# Altium schematic sheet 6_Magnetorquer_Drivers.SchDoc: Magnetorquer Drivers
size A4; DrawnBy: Sara V. Martinez; Engineer: Flight; Revision: V0.0; SheetNumber: 6; SheetTotal: 7
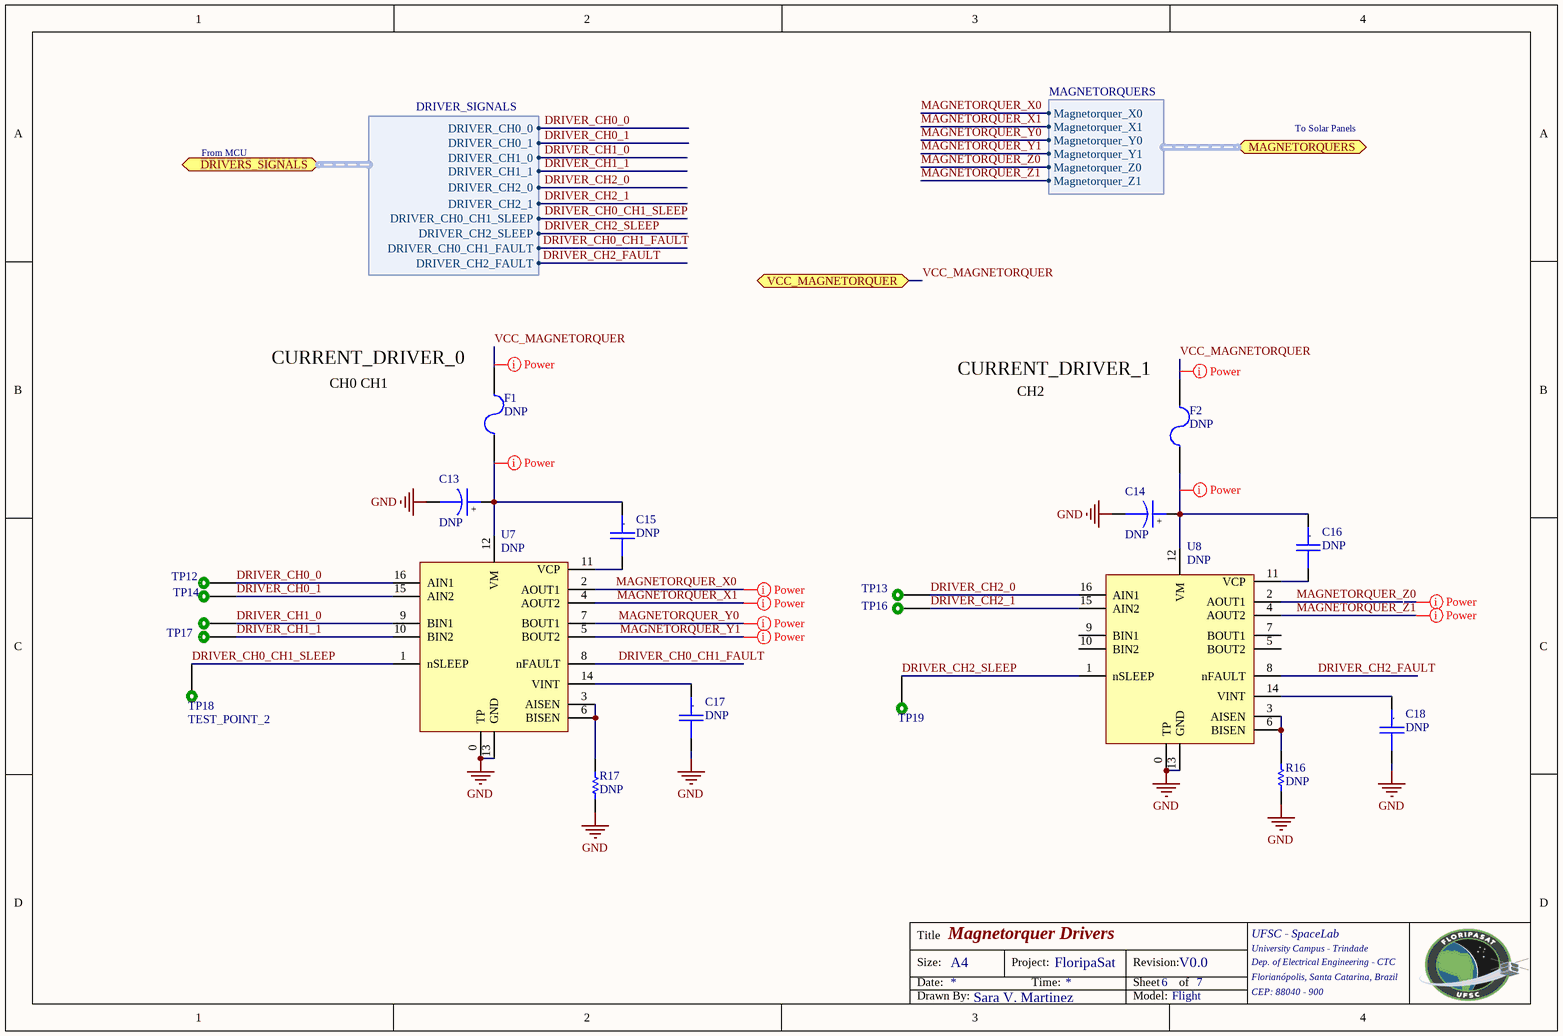
[diagram p0: 6_Magnetorquer_Drivers.SchDoc]

## Parts
C13  DNP  [CC0805_Tantalum]
C14  DNP  [CC0805_Tantalum]
C15  DNP  [CC0805]
C16  DNP  [CC0805]
C17  DNP  [CC0805]
C18  DNP  [CC0805]
F1  DNP  [1206]
F2  DNP  [1206]
R16  DNP  [0805]
R17  DNP  [0805]
TP12  TEST_POINT_2  [TEST_POINT_2]  (value not drawn)  (no BOM)
TP13  TEST_POINT_2  [TEST_POINT_2]  (value not drawn)  (no BOM)
TP14  TEST_POINT_2  [TEST_POINT_2]  (value not drawn)  (no BOM)
TP15  TEST_POINT_2  [TEST_POINT_2]  (value not drawn)  (no BOM)
TP16  TEST_POINT_2  [TEST_POINT_2]  (value not drawn)  (no BOM)
TP17  TEST_POINT_2  [TEST_POINT_2]  (value not drawn)  (no BOM)
TP18  TEST_POINT_2  [TEST_POINT_2]  (no BOM)
TP19  TEST_POINT_2  [TEST_POINT_2]  (value not drawn)  (no BOM)
U7  DNP  [16TTSSOP]
U8  DNP  [16TTSSOP]

## Ports
DRIVERS_SIGNALS (harness DRIVER_SIGNALS), MAGNETORQUERS (harness MAGNETORQUERS), VCC_MAGNETORQUER

## Harnesses
MAGNETORQUERS: Magnetorquer_X0, Magnetorquer_X1, Magnetorquer_Y0, Magnetorquer_Y1, Magnetorquer_Z0, Magnetorquer_Z1
DRIVER_SIGNALS: DRIVER_CH1_1, DRIVER_CH1_0, DRIVER_CH0_1, DRIVER_CH0_0, DRIVER_CH2_0, DRIVER_CH2_1, DRIVER_CH0_CH1_SLEEP, DRIVER_CH2_SLEEP, DRIVER_CH0_CH1_FAULT, DRIVER_CH2_FAULT

## Nets
GND: C13.2 C14.2 C17.2 C18.2 R16.1 R17.1 U7.0(TP) U7.13(GND) U8.0(TP) U8.13(GND)
DRIVER_CH0_0: TP12.1 U7.16(AIN1) ; port DRIVERS_SIGNALS.DRIVER_CH0_0
DRIVER_CH0_1: TP14.1 U7.15(AIN2) ; port DRIVERS_SIGNALS.DRIVER_CH0_1
DRIVER_CH0_CH1_FAULT: U7.8(nFAULT) ; port DRIVERS_SIGNALS.DRIVER_CH0_CH1_FAULT
DRIVER_CH0_CH1_SLEEP: TP18.1 U7.1(nSLEEP) ; port DRIVERS_SIGNALS.DRIVER_CH0_CH1_SLEEP
DRIVER_CH1_0: TP15.1 U7.9(BIN1) ; port DRIVERS_SIGNALS.DRIVER_CH1_0
DRIVER_CH1_1: TP17.1 U7.10(BIN2) ; port DRIVERS_SIGNALS.DRIVER_CH1_1
DRIVER_CH2_0: TP13.1 U8.16(AIN1) ; port DRIVERS_SIGNALS.DRIVER_CH2_0
DRIVER_CH2_1: TP16.1 U8.15(AIN2) ; port DRIVERS_SIGNALS.DRIVER_CH2_1
DRIVER_CH2_FAULT: U8.8(nFAULT) ; port DRIVERS_SIGNALS.DRIVER_CH2_FAULT
DRIVER_CH2_SLEEP: TP19.1 U8.1(nSLEEP) ; port DRIVERS_SIGNALS.DRIVER_CH2_SLEEP
MAGNETORQUER_X0: U7.2(AOUT1) ; port MAGNETORQUERS.Magnetorquer_X0
MAGNETORQUER_X1: U7.4(AOUT2) ; port MAGNETORQUERS.Magnetorquer_X1
MAGNETORQUER_Y0: U7.7(BOUT1) ; port MAGNETORQUERS.Magnetorquer_Y0
MAGNETORQUER_Y1: U7.5(BOUT2) ; port MAGNETORQUERS.Magnetorquer_Y1
MAGNETORQUER_Z0: U8.2(AOUT1) ; port MAGNETORQUERS.Magnetorquer_Z0
MAGNETORQUER_Z1: U8.4(AOUT2) ; port MAGNETORQUERS.Magnetorquer_Z1
VCC_MAGNETORQUER: F1.2 F2.2 ; port VCC_MAGNETORQUER
NetC13_1: C13.1 C15.1 F1.1 U7.12(VM)
NetC14_1: C14.1 C16.1 F2.1 U8.12(VM)
NetC15_2: C15.2 U7.11(VCP)
NetC16_2: C16.2 U8.11(VCP)
NetC17_1: C17.1 U7.14(VINT)
NetC18_1: C18.1 U8.14(VINT)
NetR16_2: R16.2 U8.3(AISEN) U8.6(BISEN)
NetR17_2: R17.2 U7.3(AISEN) U7.6(BISEN)

Not connected (* = marked no-connect by the designer): U8 5(BOUT2) 7(BOUT1) 9(BIN1) 10(BIN2)

## Layout directives
net class Power: (no net found under the mark), MAGNETORQUER_X0, MAGNETORQUER_X1, MAGNETORQUER_Y0, MAGNETORQUER_Y1, MAGNETORQUER_Z1, NetC13_1, NetC14_1, VCC_MAGNETORQUER

## Notes on the sheet
- From MCU
- To Solar Panels
- CURRENT_DRIVER_0
- CURRENT_DRIVER_1
- CH0 CH1
- CH2
- Title
- Size:
- Date:
- A4
- Project:
- Time:
- FloripaSat
- Revision:
- Sheet
- of
- UFSC - SpaceLab
- University Campus - Trindade
- Dep. of Electrical Engineering - CTC
- Florianópolis, Santa Catarina, Brazil
- Drawn By:
- Model:
- CEP: 88040 - 900
- (in symbol Cap_Cer_X7R_0.01uF_50V_0805) .
- (in symbol Cap_Cer_X7R_2.2uF_16V_0805) .
- (in symbol Cap_Tant_SMD_10uF_10V_0805) +

## Library data of the parts
C13 C14 = Cap_Tant_SMD_10uF_10V_0805: CAP Tantalum 10uF 10V 20% 0805; Partnumber: TPSP106M010R2000; NCM: 8532.21.11
C15 C16 = Cap_Cer_X7R_0.01uF_50V_0805: CAP CER 0.01uF 50V 10% X7R 0805; Partnumber: CL21B103KAANNNC; NCM: 8532.24.10
C17 C18 = Cap_Cer_X7R_2.2uF_16V_0805: CAP CER 2.2uF 16V 0805; Partnumber: C2012X7R1C225K125AB; NCM: 8532.24.10
F1 F2 = Fuse: Surface Mount Fuses SMD FA 4A; PartNumber: 0437.375WR; Published: 8-Jun-2000; LatestRevisionDate: 17-Jul-2002; LatestRevisionNote: Re-released for DXP Platform.; PackageReference: PIN-W2/E2.8; Publisher: Altium Limited; PackageDescription: Thru-Hole; 2 Leads
R16 = R0.015R_1%_0.5W_0805: RES 0.2 OHM -0.2W 1% 0805; Partnumber: RL1220S-R20-F; NCM: 8533.21.20
R17 = R0.015R_1%_0.5W_0805: RES 0.2 OHM - 0.2W 1% 0805; Partnumber: RL1220S-R20-F; NCM: 8533.21.20
TP12-TP19 = TEST_POINT_2: Test point
U7 U8 = DRV8833PWPR: Partnumber: DRV8833PWPR